# Altium schematic sheet arduino.SchDoc
size A4; SheetNumber: 1; SheetTotal: 1
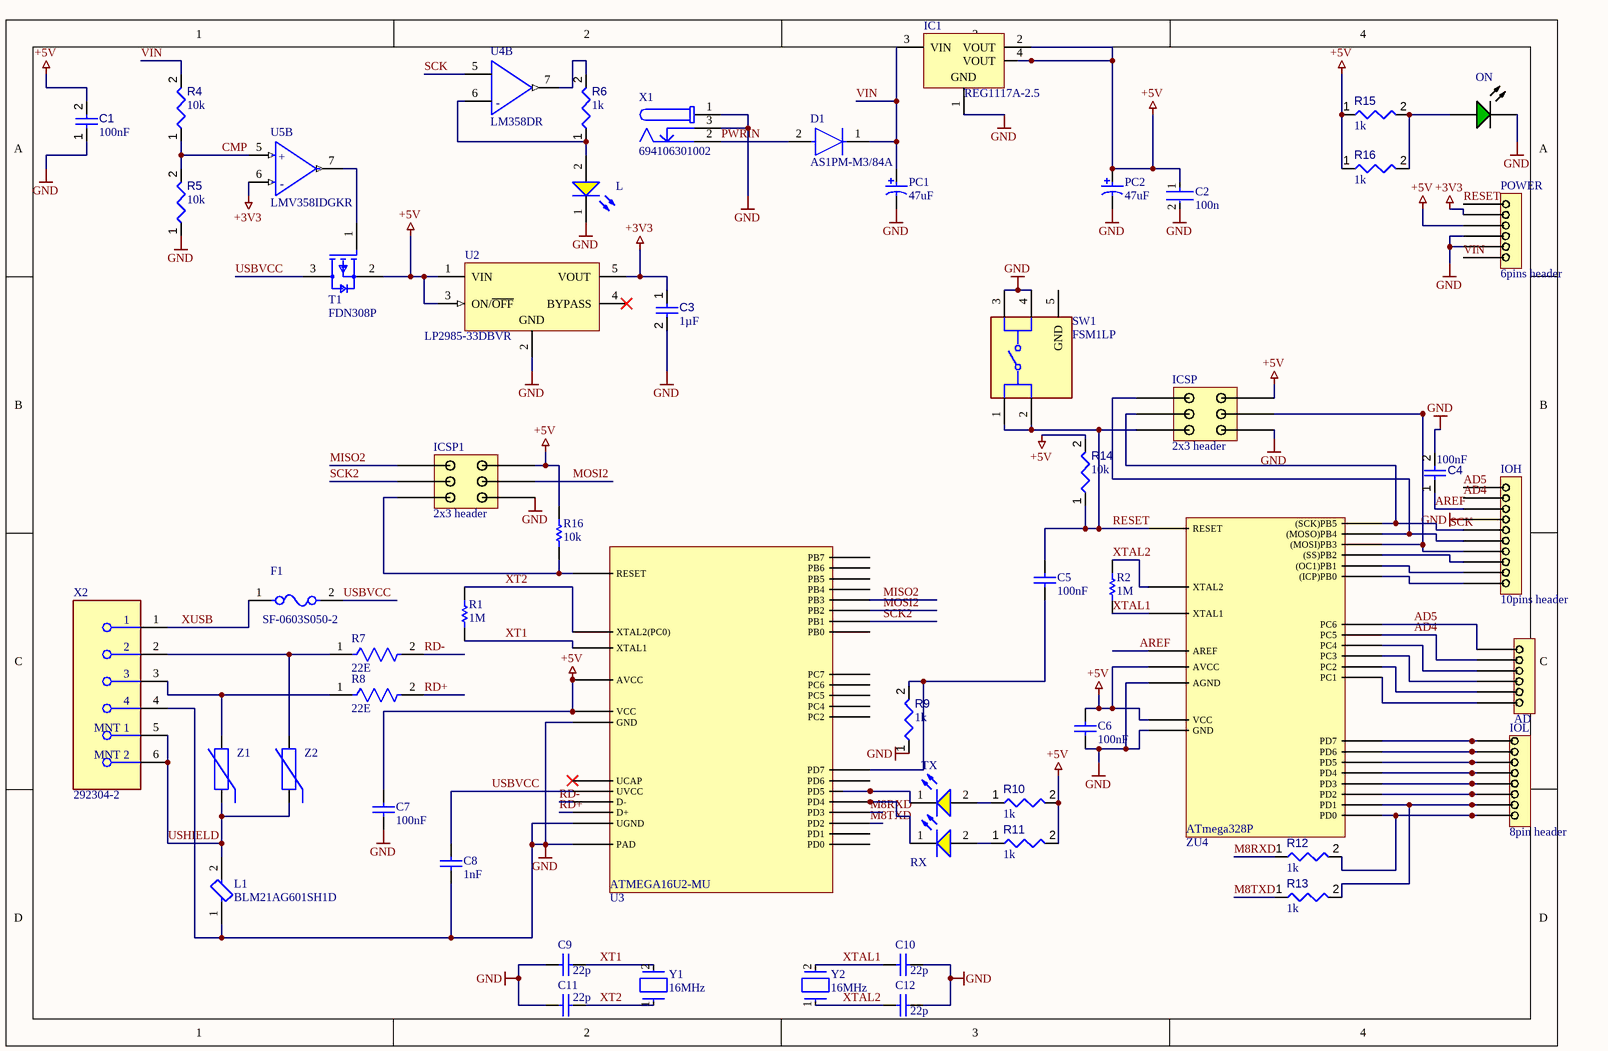
[diagram p0: arduino.SchDoc]

## Parts
(Parts that share a designator on the sheet are numbered #1, #2 ... from top to bottom, then left to right.)
AD  6pins header  [6pinheader]  (value not drawn)
C1  value 100nF  [CAPC0402(1005)60_L]  (hidden comment: Capacitor 100nF +/-20% 50V 0402)
C2  100n  [FP-C1206C-EB-MFG]
C3  value 1µF  [CAPC0402(1005)60_L]  (hidden comment: Capacitor 1µF +/-20% 10V 0402)
C4  value 100nF  [CAPC0402(1005)60_L]  (hidden comment: Capacitor 100nF +/-20% 50V 0402)
C5  100nF  [CAPC1608X87X35ML15T15]
C6  100nF  [CAPC1608X87X35ML15T15]
C7  100nF  [CAPC1608X87X35ML15T15]
C8  1nF  [CAPC1608X90X35NL15T15]
C9  22p  [CAPC1005X56X25NL10T15]
C10  22p  [CAPC1005X56X25NL10T15]
C11  22p  [CAPC1005X56X25NL10T15]
C12  22p  [CAPC1005X56X25NL10T15]
D1  AS1PM-M3/84A  [FP-96547-MFG]
F1  SF-0603S050-2  [FP-SF-0603S-MFG]
IC1  REG1117A-2.5  [DCY0004A_L]
ICSP  2x3 header  [header2x3]
ICSP1  2x3 header  [header2x3]
IOH  10pins header  [10pin header]
IOL  8pin header  [8pin]
L  150060YS75000  [WL-SMCW_0603_150060xx75000]  (value not drawn)
L1  BLM21AG601SH1D  [FP-BLM21-0_2-t0_85-e0_5-MFG]
ON  HSMG-C190  [AVAG-HSMX-C190_V]  (value not drawn)
PC1  47uF  [NIC-CAPA2-6.3X5.8_V]
PC2  47uF  [NIC-CAPA2-6.3X5.8_V]
POWER  6pins header  [6pinheader]
R1  1M  [RESC1608X55X25LL10T15]
R2  1M  [RESC1608X55X25LL10T15]
R4  value 10k  [RESC1608X55X25ML10T15]  (hidden comment: Resistor 10k +/-1% 0603 100 mW)
R5  value 10k  [RESC1608X55X25ML10T15]  (hidden comment: Resistor 10k +/-1% 0603 100 mW)
R6  value 1k  [RESC0402(1005)_L]  (hidden comment: Resistor 1K +/-5 % 0402 63 mW)
R7  22E  [FP-ESR01-MFG]
R8  22E  [FP-ESR01-MFG]
R9  value 1k  [RESC0402(1005)_L]  (hidden comment: Resistor 1K +/-5 % 0402 63 mW)
R10  value 1k  [RESC0402(1005)_L]  (hidden comment: Resistor 1K +/-5 % 0402 63 mW)
R11  value 1k  [RESC0402(1005)_L]  (hidden comment: Resistor 1K +/-5 % 0402 63 mW)
R12  value 1k  [RESC0402(1005)_L]  (hidden comment: Resistor 1K +/-5 % 0402 63 mW)
R13  value 1k  [RESC0402(1005)_L]  (hidden comment: Resistor 1K +/-5 % 0402 63 mW)
R14  value 10k  [RESC1608X55X25ML10T15]  (hidden comment: Resistor 10k +/-1% 0603 100 mW)
R15  value 1k  [RESC0402(1005)_L]  (hidden comment: Resistor 1K +/-5 % 0402 63 mW)
R16#1  value 1k  [RESC0402(1005)_L]  (hidden comment: Resistor 1K +/-5 % 0402 63 mW)
R16#2  10k  [RESC1608X50X30ML20T20]
RX  150060YS75000  [WL-SMCW_0603_150060xx75000]  (value not drawn)
SW1  FSM1LP  [FP-FSM1LP-MFG]
T1  FDN308P  [FP-527AG-MFG]
TX  RX  [WL-SMCW_0603_150060xx75000]  (value not drawn)
U2  LP2985-33DBVR  [DBV0005A_M]
U3  ATMEGA8U2-MU  [PCBComponent_1]  (value not drawn)
U4  LM358DR  [FP-D0008A-MFG]  (part B of 2)
U5  LMV358IDGKR  [FP-DGK0008A-IPC_C]  (part B of 2)
X1  694106301002  [694106301002]
X2  292304-2  [FP-292304-2-MFG]
Y1  16MHz  [FP-ABM3-MFG]
Y2  16MHz  [FP-ABM3-MFG]
Z1  CG0603MLC-05E  [BOUR-CG0603-2_V]  (value not drawn)
Z2  CG0603MLC-05E  [BOUR-CG0603-2_V]  (value not drawn)
ZU4  ATMEGA8  [ATmega328P]  (value not drawn)

## Nets
+3V3: C3.1 POWER.2 U2.5(VOUT) U5.6(2IN-)
+5V: C1.2 C2.1 C6.2 C7.2 IC1.2(VOUT) IC1.4(VOUT) ICSP.66 ICSP1.66 PC2.1 POWER.3(PC6) R10.2 R11.2 R14.2 R15.1 R16#1.1 R16#2.2 T1.2(S) U2.1(VIN) U2.3(ON/~{OFF}) U3.4(VCC) U3.32(AVCC) ZU4.36(VCC) ZU4.50(AVCC)
GND: C1.1 C2.2 C3.2 C4.2 C6.1 C7.1 C8.1 C9.1 C10.1 C11.1 C12.1 IC1.1(GND) ICSP.70 ICSP1.70 IOH.92 L.1(K) L1.1 ON.2(K) PC1.2 PC2.2 POWER.4(PC6) POWER.5(PC6) R5.1 R9.1 SW1.3 SW1.4 U2.2(GND) U3.1(PAD) U3.3(GND) U3.28(UGND) X1.1 X1.3 X2.4 ZU4.35(AGND)
AD4: AD.75 IOH.94(PC6) ZU4.60(PC5)
AD5: AD.76(PC6) IOH.95(PC6) ZU4.61(PC6)
AREF: C4.1 IOH.93(PC6) ZU4.52(AREF)
CMP: R4.1 R5.2 U5.5(2IN+)
M8RXD: R12.1 U3.9(PD3)
M8TXD: R13.1 U3.8(PD2)
MISO2: ICSP1.65 U3.17(PB3)
MOSI2: ICSP1.68 U3.13(PB2)
PWRIN: D1.2(A) X1.2
RD+: R8.2 U3.29(D+)
RD-: R7.2 U3.30(D-)
RESET: C5.1 ICSP.69 POWER.1(PC6) R14.1 SW1.1 SW1.2 ZU4.61(RESET)
SCK: ICSP.67 IOH.91(PC6) U4.5(IN2+) ZU4.49((SCK)PB5)
SCK2: ICSP1.67 U3.15(PB1)
USBVCC: C8.2 F1.2 T1.3(D) U3.31(UVCC)
USHIELD: L1.2 X2.5(MNT_1) X2.6(MNT_2) Z1.1 Z2.1
VIN: D1.1(C) IC1.3(VIN) PC1.1 POWER.6(PC6) R4.2
XT1: C9.2 R1.1 U3.1(XTAL1) Y1.2
XT2: C11.2 R1.2 U3.2(XTAL2(PC0)) Y1.1
XTAL1: C10.2 R2.1 Y2.2 ZU4.39(XTAL1)
XTAL2: C12.2 R2.2 Y2.1 ZU4.40(XTAL2)
XUSB: F1.1 X2.1
NetAD_71: AD.71(PC6) ZU4.56(PC1)
NetAD_72: AD.72(PC6) ZU4.57(PC2)
NetAD_73: AD.73(PC6) ZU4.58(PC3)
NetAD_74: AD.74(PC6) ZU4.59(PC4)
NetC5_2: C5.2 R9.2 U3.13(PD7)
NetICSP1_69: ICSP1.69 R16#2.1 U3.24(RESET)
NetICSP_65: ICSP.65 IOH.90 ZU4.48((MOSO)PB4)
NetICSP_68: ICSP.68 IOH.89(PC6) ZU4.47((MOSI)PB3)
NetIOH_86: IOH.86(PC6) ZU4.44((ICP)PB0)
NetIOH_87: IOH.87(PC6) ZU4.45((OC1)PB1)
NetIOH_88: IOH.88(PC6) ZU4.46((SS)PB2)
NetIOL_78: IOL.78(PC6) R12.2 ZU4.62(PD0)
NetIOL_79: IOL.79(PC6) R13.2 ZU4.63(PD1)
NetIOL_80: IOL.80(PC6) ZU4.64(PD2)
NetIOL_81: IOL.81(PC6) ZU4.33(PD3)
NetIOL_82: IOL.82 ZU4.34(PD4)
NetIOL_83: IOL.83(PC6) ZU4.41(PD5)
NetIOL_84: IOL.84 ZU4.42(PD6)
NetIOL_85: IOL.85(PC6) ZU4.43(PD7)
NetL_2: L.2(A) R6.1 U4.6(IN2-)
NetON_1: ON.1(A) R15.2 R16#1.2
NetR6_2: R6.2 U4.7(2OUT)
NetR7_1: R7.1 X2.2 Z2.2
NetR8_1: R8.1 X2.3 Z1.2
NetR10_1: R10.1 TX.2(A)
NetR11_1: R11.1 RX.2(A)
NetRX_1: RX.1(K) U3.10(PD4)
NetT1_1: T1.1(G) U5.7(2OUT)
NetTX_1: TX.1(K) U3.11(PD5)

Not connected (* = marked no-connect by the designer): SW1 5(GND); U2 4(BYPASS)*; U3 5(PC2) 6(PD0) 7(PD1) 12(PD6) 14(PB0) 18(PB4) 19(PB5) 20(PB6) 21(PB7) 22(PC7) 23(PC6) 25(PC5) 26(PC4) 27(UCAP)*

## Notes on the sheet
- (in symbol ATMEGA8) ATmega328P
- (in symbol ATMEGA8U2-MU) ATMEGA16U2-MU
- (in symbol CMP-1685-00009-2, part B) -
- (in symbol CMP-2100-03651-2, part B) +; -

## Library data of the parts
C1 C4 = CMP-001-00067-3: Chip Capacitor, 100nF +/-20%, 50V, 0402, Thickness 0.6 mm; Tolerance: 10%; Min Operating Temperature: -55°C; Pins: 2; Case/Package: 0402; Max Operating Temperature: 85°C; Voltage Rating: 50V; Mounting Technology: SMT
C2 = CMP-1037-04222-2: CAP CER 0.1UF 200V 10% X7R 1206; Manufacturer Part Number: C1206C104K2RACTU; Manufacturer: KEMET; Automotive Grade: Grade 0; Tolerance: 0.1; Value: 0.10 μF; Material: Ceramic; Temperature Coefficient: 15%; Automotive: Yes; Temperature Characteristic: X7R; Digikey Description: CAP CER 0.1UF 200V 10% X7R 1206; ComponentLink2URL: https://content.kemet.com/datasheets/KEM_C1007_X8R_ULTRA_150C_SMD.pdf; Voltage Rating: 200 V; Temperature Range High: +150°C; Device Class L1: Passive Components; Octopart: https://octopart.com/c1206c104k2ractu-kemet-9138344; Temperature: -55°C to +150°C; Height: 0.88mm; Device Class L3: Ceramic Capacitors; Lead Free: Yes; Package: C1206C-EB; Category: Cap; Temperature Range Low: -55°C; Mouser Description: Multilayer Ceramic Capacitors MLCC - SMD/SMT 200volts 0.1uF X7R 10%; Ipc Land Pattern Name: CAPC320160X78; Capacitance: 0.10 μF; RoHS: TRUE; ComponentLink2Description: Datasheet; Device Class L2: Capacitors
C3 = CMP-001-00063-3: Chip Capacitor, 1µF +/-20%, 10V, 0402, Thickness 0.6 mm; Tolerance: 10%; Mounting Technology: SMT; Max Operating Temperature: 85°C; Voltage Rating: 10V; Pins: 2; Case/Package: 0402; Min Operating Temperature: -55°C
C5-C7 = CMP-2006-03295-1: Part Number: C0603T104K3RCLTU; Manufacturer: Kemet
C8 = CMP-2006-04069-1: Manufacturer: AVX Interconnect / Elco; Part Number: 06031C102KAT4A
C9-C12 = CMP-1034-00918-2: Part Number: 04025A220KAT2A; Manufacturer: AVX Interconnect / Elco
D1 = CMP-02540-000039-1: DIODE AVALANCHE 1KV 1.5A DO220; Manufacturer: Vishay; Automotive Grade: Grade 0; Peak Reverse Current: 0.3uA; Value: 10.4pF; Max Junction Temp: +175°C; Max Repetitive Reverse Voltage: 1000V; Max Surge Forward Current: 30A; Package: 96547; Forward Current: 1.5A; Manufacturer Part Number: AS1PM-M3/84A; Automotive: Yes; Octopart: https://octopart.com/as1pm-m3%2F84a-vishay-44629776; Mouser Description: AS1PM-M3/84A; SMT Avalanche Diode; 1000V 1.5A; 1.5us; 2-Pin DO-220AA; Temperature Range High: +175°C; RoHS: TRUE; Lead Free: Yes; Temperature Range Low: -55°C; Device Class L3: Rectifier Diodes; Temperature: -55°C to +175°C; ComponentLink2URL: https://www.vishay.com/docs/89290/as1pm.pdf; Device Class L2: Diodes; Footprint Url: https://www.vishay.com/docs/96547/smp_do-220aa.pdf; Device Class L1: Discrete Semiconductors; Digikey Description: DIODE AVALANCHE 1KV 1.5A DO220; Capacitance: 10.4pF; Height: 1.15mm; ComponentLink2Description: Datasheet; Category: Diode
F1 = CMP-07399-000004-1: FUSE BOARD MNT 500MA 50VDC 0603; Manufacturer: Bourns Inc.; Fuse I2T: 0.009A2Sec; Fuse Current: 0.5A; Fuse Interrupt Ac Current: 50A; Max Fuse Ac Voltage: 35V; Resistance: 232mΩ; Fuse Blow Speed: Slow; Value: 232mΩ; Max Fuse Dc Voltage: 50V; Automotive: No; Category: Fuse; Temperature Range High: +105°C; Device Class L1: Circuit Protection; Height: 0.55mm; RoHS: TRUE; ComponentLink2URL: https://www.bourns.com/docs/product-datasheets/sf0603s.pdf; Ipc Land Pattern Name: CAPC16080X45; Temperature Range Low: -20°C; Mouser Description: Surface Mount Fuses 0.50A Slow Blow SinglFuse; Manufacturer Part Number: SF-0603S050-2; Package: SF-0603S; Device Class L3: unset; Digikey Description: FUSE BOARD MNT 500MA 50VDC 0603; Device Class L2: Fuses; Lead Free: Yes; Temperature: -20°C to +105°C; ComponentLink2Description: Datasheet; Octopart: https://octopart.com/sf-0603s050-2-bourns-10486821; Fuse Interrupt Dc Current: 50A
IC1 = CMP-0395-00519-2: Single Output LDO, 1 A, Fixed 2.5 V Output, 3.8 to 15 V Input, with Internal Current Limiting, 4-pin SOT-223 (DCY), -40 to 125 degC, Green (RoHS & no Sb/Br); Manufacturer: Texas Instruments; SubFamily: Single Channel LDO; Vdo(Typ)(mV): 1200; Vin(Min)(V): 3.8; Fixed Output Options(V): 2.5; Rating: Catalog; Vin(Max)(V): 15; Iout(Max)(A): 1; Iq(Typ)(mA): 4; Eco-Plan: Green (RoHS & no Sb/Br); PackageReference: DCY0004A; PartNumber: REG1117A-2.5; DatasheetVersion: SBVS001D; ComponentLink1Description: Manufacturer URL; Vout Adj(Min)(V): 2.5; Mounting Technology: Surface Mount; PackageDescription: 4-Pin Plastic Small Outline, Body 3.5 x 6.5 mm, Pitch 2.3 mm; Vout Adj(Max)(V): 2.5; Code_JEDEC: TO-261; ComponentLink3URL: http://www.ti.com/litv/pdf/mpds094a; ComponentLink2URL: http://www.ti.com/general/docs/lit/getliterature.tsp?genericPartNumber=REG1117A-25&fileType=pdf; ComponentLink2Description: Datasheet; ComponentLink3Description: Package Specification; PackageVersion: 4202506/B; ComponentLink1URL: http://www.ti.com/
L RX TX = CMP-1426-00005-2: NexarPartId: 29687085; Wavelength: 590nm; Luminous Intensity: 120mcd; Peak Wavelength: 595nm; Forward Current: 100mA; Power Dissipation: 72mW; Forward Voltage: 2V; Test Current: 20mA; Reverse Voltage: 5V; Lens Style: Clear, Rectangular; Max Junction Temperature (Tj): 95°C; Viewing Angle: 140°; Case Code (Imperial): 0603; Height: 700µm; REACH SVHC: Unknown; Dominant Wavelength: 590nm; Min Operating Temperature: -40°C; Color: Yellow; Width: 800µm; Mount: Surface Mount; Packaging: Tape and Reel; Max Operating Temperature: 85°C; RoHS: Compliant; Max Reverse Voltage (DC): 5V; Case Code (Metric): 1608; Length: 1.6mm; Case/Package: 0603
L1 = CMP-06046-002599-1: Chip Ferrite Bead, 0805, 600Ω @ 100MHz, 0.2Ω, 25%, 700mA; Number of Circuits: 1; DC Resistance (DCR): 210mR; Max DC Current: 200mA; Impedance: 600R; Max Current Rating: 600mA; Contact Plating: Tin; Ratings: AEC-Q200; Case Code (Metric): 2012; Height: 0.041inch; Packaging: Tape and Reel; Package Quantity: 4000; Case/Package: 0805; Lead Free: Lead Free; Case Code (Imperial): 0805; REACH SVHC: No SVHC; RoHS Compliant: Yes; Termination: SMD/SMT; Length: 2mm; Tolerance: 25%; Width: 0.049inch; Mount: Surface Mount; Min Operating Temperature: -55°C; Test Frequency: 100MHz; Max Operating Temperature: 125°C; Number of Lines: 1; Series: EMIFIL®, BLM21A
ON = CMP-007-00013-2: LED Uni-Color Green, 52 mW, 20 mA, -40 to 85 degC, 2-Pin SMD, RoHS, Tape and Reel; Manufacturer: Avago; Forward Current: 20mA; Viewing Angle: 170degrees; Luminous Intensity: 15mcd; Lens Style: Diffused; Forward Voltage: 2.2V; Power: 52mW; Mounting Technology: SM; RoHS Compliant: True; Packaging: TapeandReel; Illumination Colour: Green; Datasheet URL: http://docs.avagotech.com/docs/AV02-0551EN; Min Operating Temperature: -40°C; Max Operating Temperature: 85°C; Pins: 2; Package Description: 2-Pin Surface Mount Device, Body 1.6 x 0.8 mm, Height 0.9 mm; Nominal Vf: 2.2V; Case/Package: 0603; Manufacturer URL: http://www.avagotech.com/; Datasheet Version: Mar-12; Colour: Green; Package Reference: HSMX-C190; Package Quantity: 4000
PC1 PC2 = CMP-0687-00039-1: Aluminum Electrolytic Capacitor, UD Series, Low Impedance, 47 uF, 25 V, + / - 20%, -55 to 105 degC, Chip Type, 6.3 x 5.8 mm D x L, Pb-Free, Reel; Manufacturer: Nichicon; PartNumber: UUD1E470MCL1GS; Rated Ripple Current (at 100kHz): 230 mA; Endurance Time: 2000 h; Packing: Dia382mm Reel; Rated Voltage: 25 V; Impedance: 0.44 Ohm; Tolerance Rated Capacitance: -20 to 20%; Mounting Technology: Surface Mount; Diameter: 6.3 mm; ComponentLink3Description: Package Specification; ComponentLink2Description: Datasheet; PackageReference: CAPAE-D6.3H5.8; RoHS: TRUE; Length: 5.8 mm; ComponentLink1URL: http://www.nichicon.co.jp/; PackageDescription: 2-Pin Surface Mount Device, Diameter 6.3 mm, Height 5.8 mm, Pitch 5.4 mm; ComponentLink2URL: http://products.nichicon.co.jp/en/pdf/XJA043/e-ud.pdf; Rated Capacitance: 47 uF; ComponentLink1Description: Manufacturer URL; ComponentLink3URL: http://products.nichicon.co.jp/en/pdf/XJA043/e-ud.pdf; DatasheetVersion: 08/2012
R1 R2 = CMP-1659-00056-1: Chip Resistor, 1 MOhm, +/- 1%, 100 mW, -55 to 155 degC, 0603 (1608 Metric), RoHS, Tape and Reel; Voltage Rating (DC): 25 V; Tolerance: 20%; Case\Package: Radial; Capacitance: 1 mF; Min Operating Temperature: -40 degC; PackageDescription: 2-Pin Surface Mount Device, Body 1.6 x 0.8 mm; ComponentLink1Description: Manufacturer URL; Radiation Hardening: No; DatasheetVersion: Rev. 4, 02/2016; REACH SVHC: No SVHC; Length: 20 mm; Max Operating Temperature: 85 degC; Diameter: 10 mm; Packaging: Bulk; Package Quantity: 200; PackageReference: 0603; Mount: Through Hole; ComponentLink1URL: http://www.yageo.com/; ComponentLink2URL: http://www.yageo.com/documents/recent/PYu-RC_Group_51_RoHS_L_04.pdf; ComponentLink2Description: Datasheet; Width: 0 inch; Lead Pitch: 5 mm; RoHSCompliant: true; Voltage Rating: 25 V; Height: 20 mm
R4 R5 R14 = CMP-009-00017-5: Chip Resistor, 10 KOhm, +/- 1%, 01 W, -55 to 155 degC, 0603 (1608 Metric); Voltage Rating: 50V; Power: 100mW; RoHS Compliant: True; Min Operating Temperature: -55°C; Pins: 2; Case/Package: 0603; Mounting Technology: SM; Max Operating Temperature: 155°C; Tolerance: 1%
R6 R9-R13 R15 R16#1 = CMP-009-00157-3: Chip Resistor, 1 kOhms, +/-5 %, 63 mW, -55 to 155 degC, 0402; Tolerance: 5%; Power: 63mW; Case/Package: 0402; Pins: 2; Min Operating Temperature: -55°C; Max Operating Temperature: 155°C
R7 R8 = CMP-08839-028734-1: 22Ω ±5% 0.2W 0402 Anti-Surge Chip Resistor AEC-Q200; Max Power Dissipation: 200mW; Temperature Coefficient: 200ppm/°C; Resistance: 22R; Resistor Type: Thick Film; Case Code (Imperial): 0402; Min Operating Temperature: -55°C; Number of Terminations: 2; Height: 0.016inch; Series: ESR; Max Operating Temperature: 155°C; Case/Package: 0402; Features: Automotive AEC-Q200; Case Code (Metric): 1005; Width: 0.02inch; Packaging: Cut Tape; Tolerance: 5%; Length: 0.039inch; Package Quantity: 1; RoHS Compliant: Yes
R16#2 = CMP-2000-02822-1: Manufacturer: Susumu; Part Number: RG1608N-103-W-T1
SW1 = CMP-03402-000015-1: SWITCH TACTILE SPST-NO 0.05A 24V; Electrical Life: 100000Cycles; Actuator Type: Standard; Contact Resistance: 100mR; Current Rating: 50mA; Operating Force: 1.57N; Actuator Material: Polyphthalamide; Illumination Type: Non-Illuminated; Actuator Length: 0.01inch; Voltage Rating (DC): 12V; Throw Configuration: SPST; Switch Travel: 0.25mm; Switch Function: Off-Mom; Actuator Color: Black; Length: 6.19mm; Min Operating Temperature: -35°C; Contact Material: Copper Alloy; Max Current Rating: 50mA; Max Operating Temperature: 85°C; Packaging: Loose Piece; Lead Free: Lead Free; Mount: Surface Mount; RoHS Compliant: Yes; Orientation: Straight; Package Quantity: 2000; Mechanical Life: 100000Cycles; Type: Switch; ELV: Compliant; Depth: 8mm; Contact Plating: Silver; Max Voltage Rating (DC): 12V; REACH SVHC: No SVHC; Series: FSM1LP; Contact Current Rating: 50mA; Termination: Gull Wing
T1 = CMP-07173-000119-1: MOSFET P-CH 20V 1.5A SSOT-3; Drain to Source Breakdown Voltage: -20V; Drain to Source Resistance: 86mR; On-State Resistance: 125MR; Gate to Source Voltage (Vgs): 12V; Nominal Vgs: -1V; Max Power Dissipation: 500mW; Input Capacitance: 341pF; Current Rating: -1.5A; Rise Time: 10ns; Turn-Off Delay Time: 12ns; Number of Elements: 1; Element Configuration: Single; Turn-On Delay Time: 8ns; Height: 0.94mm; Lead Free: Lead Free; Package Quantity: 1; Case/Package: TO-236-3; Min Operating Temperature: -55°C; Rds On Max: 125mR; Packaging: Tape and Reel; REACH SVHC: No SVHC; Weight: 0.03g; Fall Time: 10ns; Length: 2.92mm; Continuous Drain Current (ID): 1.5A; Number of Pins: 3; Width: 1.4mm; Max Operating Temperature: 150°C; Threshold Voltage: -1V; Voltage Rating (DC): -20V; Mount: Surface Mount; Power Dissipation: 500mW; Drain to Source Voltage (Vdss): 20V
U2 = CMP-0758-00080-2: Single Output Low Noise LDO, 150 mA, Fixed 3.3 V Output, 1.5% Tolerance, 2.2 to 16 V Input, Low IQ, 5-Pin SOT-23 (DBV), -40 to 125 degC, Green (RoHS & no Sb/Br), Tape and Reel; Manufacturer: Texas Instruments; Vdo (Typ) (mV): 280; Accuracy (%): 1.5; Output Options: Fixed Output; Fixed Output Options (V): 3.3; Iout (Max) (A): 0.15; Iq (Typ) (mA): 0.85; ComponentLink3Description: Package Specification; Packing: Tape and Reel; ComponentLink3URL: http://www.ti.com/litv/pdf/mpds018j; Vin (V): 2.2 to 16; Mounting Technology: Surface Mount; ComponentLink1URL: http://www.ti.com/; PartNumber: LP2985-33DBVR; PackageReference: DBV0005A; ComponentLink2URL: http://www.ti.com/lit/ds/symlink/lp2985-50.pdf; RoHS: TRUE; ComponentLink2Description: Datasheet; PackageVersion: 4073253-4/L; Operating Temperature Range (degC): -40 to 125; DatasheetVersion: SLVS522N; ComponentLink1Description: Manufacturer URL; PackageDescription: 5-Pin Plastic Small Outline, Body 2.9 x 1.6 mm, Pitch 0.95 mm
U4 = CMP-1685-00009-2: IC OPAMP GP 2 CIRCUIT 8SOIC; Output Current: 30mA; Min Dual Supply Voltage: 1.5V; Input Offset Voltage (Vos): 7mV; Power Supply Rejection Ratio (PSRR): 65dB; Unity Gain Bandwidth Product: 700kHz; Number of Channels: 2; Min Supply Voltage: 3V; Max Dual Supply Voltage: 16V; Dual Supply Voltage: 9V; Max Supply Voltage: 32V; Nominal Supply Current: 1.2mA; Slew Rate: 0.3V/µs; Input Bias Current: 250nA; Voltage Gain: 100dB; Operating Supply Current: 1mA; REACH SVHC: No SVHC; Package Quantity: 2500; Width: 3.91mm; Max Operating Temperature: 70°C; Min Operating Temperature: 0°C; Mount: Surface Mount; Length: 4.9mm; Radiation Hardening: No; Case/Package: SOIC; Lead Free: Lead Free; Number of Elements: 2; Packaging: Tape and Reel; Output Current per Channel: 30mA; Number of Circuits: 2; Bandwidth: 700kHz; Operating Supply Voltage: 16V; Gain Bandwidth Product: 700kHz; Number of Pins: 8; Number of Amplifiers: 2; Height: 1.58mm; Common Mode Rejection Ratio: 65dB; Contact Plating: Gold
U5 = CMP-2100-03651-2: IC OPAMP GP 2 CIRCUIT 8VSSOP; Operating Supply Current: 210uA; Number of Channels: 2; Common Mode Rejection Ratio: 50dB; Input Offset Voltage (Vos): 7mV; Slew Rate: 1V/µs; Output Current: 160mA; Nominal Supply Current: 440uA; Voltage Gain: 100dB; Input Bias Current: 250nA; Gain Bandwidth Product: 1MHz; Min Supply Voltage: 2.7V; Max Supply Voltage: 5.5V; Mount: Surface Mount; Packaging: Tape and Reel; Length: 3mm; Package Quantity: 1; Min Operating Temperature: -40°C; Width: 3mm; Height: 0.97mm; Max Operating Temperature: 125°C; REACH SVHC: No SVHC; Radiation Hardening: No; Power Supply Rejection Ratio (PSRR): 50dB; Lead Free: Lead Free; Case/Package: MSOP; Contact Plating: Gold; Number of Circuits: 2; Unity Gain Bandwidth Product: 1MHz; Number of Pins: 8; Bandwidth: 1MHz; Output Current per Channel: 160mA; Number of Amplifiers: 2; Number of Elements: 2
X1 = CMP-1502-00188-2: NexarPartId: 52676100; Voltage Rating (DC): 20V; Gender: Male; Voltage Rating: 24V; Connector Type: Power; Insulation Resistance: 100MΩ; Current Rating: 5A; Shielding: Unshielded; Number of Contacts: 3; Color: Black; Housing Material: Polyamide; Contact Gender: Female; REACH SVHC: Unknown; Termination: Through Hole; Height: 11mm; RoHS: Compliant; Mount: Through Hole; Flammability Rating: UL94 V-0; Packaging: Bulk; Min Operating Temperature: -40°C; Contact Plating: Tin; Max Operating Temperature: 85°C; Operating Supply Voltage: 24V; Contact Material: Gold, Tin
X2 = CMP-03360-000001-1: CONN RCPT USB2.0 TYPEB 4POS R/A; Manufacturer: TE Connectivity; Shielding: true; Conn Orientation: Right Angle; Current Rating: 1A; Number Of Contacts: 4; Pitch: 2.5mm; Is Female: yes; Temperature Range High: +85°C; Device Class L3: unset; RoHS: TRUE; ComponentLink2Description: Datasheet; Package: 292304-2; Manufacturer Part Number: 292304-2; Device Class L2: USB Connectors; Digikey Description: CONN RCPT USB2.0 TYPEB 4POS R/A; Temperature Range Low: -55°C; Usb Standard: USB 2.0; Device Class L1: Connectors; Mouser Description: USB Connectors RECEPTACLE TYPE B; Automotive: No; Lead Free: Yes; Category: Conn; ComponentLink2URL: https://upverter.com/datasheet/eb4ef8d2f908e3ccc324fdf977e2747da9451c92.pdf; Height: 11.5mm; Octopart: https://octopart.com/292304-2-te+connectivity-39545353; Temperature: -55°C to +85°C; Contact Material: Gold,Nickel
Y1 Y2 = CMP-27762-013555-1: Crystal 16MHz ±20ppm 18pF SMD-2 5mm x 3.2mm; ESR (Equivalent Series Resistance): 40R; Frequency Stability: 50ppm; Series Resistance: 60R; Frequency Tolerance: 20ppm; Min Operating Temperature: -20°C; Frequency: 16MHz; Max Operating Temperature: 70°C; Depth: 3.2mm; Length: 5mm; Height: 0.051inch; Mount: Surface Mount; Resistor Type: Ceramic; Package Quantity: 1000; Number of Pins: 2; Width: 3.2mm; Case/Package: CSMD; Tolerance: 20ppm; Series: ABM3; Termination: SMD/SMT; Accuracy: 20ppm; REACH SVHC: Yes; Load Capacitance: 18pF; Operating Frequency: 16 MHz; Lead Free: Lead Free; Packaging: Tape and Reel
Z1 Z2 = CMP-0584-00001-2: ESD Protector, 5 V Supply, -40 to 85 degC, 1.6 x 0.8 x 0.55 mm SMD, RoHS, Tape and Reel; Manufacturer: Bourns; VC: 20 V; VT: 150 V; RT: 1 ns; VDC: 5 V; CO: 0.5 pF; PartNumber: CG0603MLC-05E; ComponentLink1Description: Manufacturer URL; ComponentLink1URL: http://www.bourns.com/; Packing: Tape and Reel; Mounting Technology: Surface Mount; ComponentLink2Description: Datasheet; RoHS: TRUE; Operating Temperature: -40 to 85 degC; DatasheetVersion: Rev. S; PackageDescription: 2-Pin SMD, Body 1.6 x 0.8 mm, Pitch 1.52 mm; PackageReference: CG0603-2; ComponentLink2URL: http://www.bourns.com/data/global/pdfs/MLC.pdf